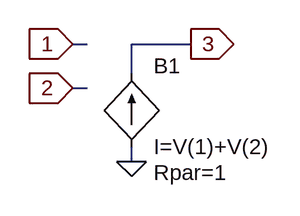
[diagram p0: schematic Summer++.asc]
Summer++.asc, the LTspice schematic file:
Version 4
SHEET 1 880 680
WIRE 96 288 96 272
WIRE 96 192 96 160
WIRE 96 160 160 160
WIRE 32 160 48 160
WIRE 32 208 48 208
FLAG 32 160 1
IOPIN 32 160 In
FLAG 32 208 2
IOPIN 32 208 In
FLAG 160 160 3
IOPIN 160 160 Out
FLAG 96 288 0
SYMBOL bi 96 272 M180
WINDOW 0 24 88 Left 0
WINDOW 3 24 0 Left 0
WINDOW 123 24 -28 Left 0
SYMATTR InstName B1
SYMATTR Value I=V(1)+V(2)
SYMATTR Value2 Rpar=1

The netlist it stands for:
* Summer++.asc
B1 0 3 I=V(1)+V(2) Rpar=1
.backanno
.end